# EAGLE design MikroBusSilToDil (EAGLE 6.4)
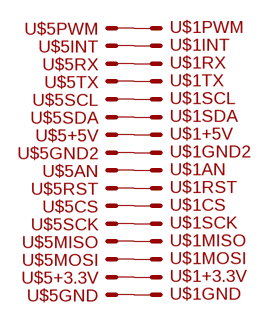
[diagram p0: schematic, sheet 1]

## Parts
U$1  MIKROBUS900MIL  [MIKROBUS]
U$5  MIKROBUSSIL  [MIKROBUS_SIL]

## Nets
N$1: U$1.PWM U$5.PWM
N$2: U$1.INT U$5.INT
N$3: U$1.RX U$5.RX
N$4: U$1.TX U$5.TX
N$5: U$1.SCL U$5.SCL
N$6: U$1.SDA U$5.SDA
N$7: U$1.+5V U$5.+5V
N$8: U$1.GND2 U$5.GND2
N$9: U$1.AN U$5.AN
N$10: U$1.RST U$5.RST
N$11: U$1.CS U$5.CS
N$12: U$1.SCK U$5.SCK
N$13: U$1.MISO U$5.MISO
N$14: U$1.MOSI U$5.MOSI
N$15: U$1.+3.3V U$5.+3.3V
N$16: U$1.GND U$5.GND

## Library data of the parts
U$1 U$5 = lieven:MIKROBUS

## Board
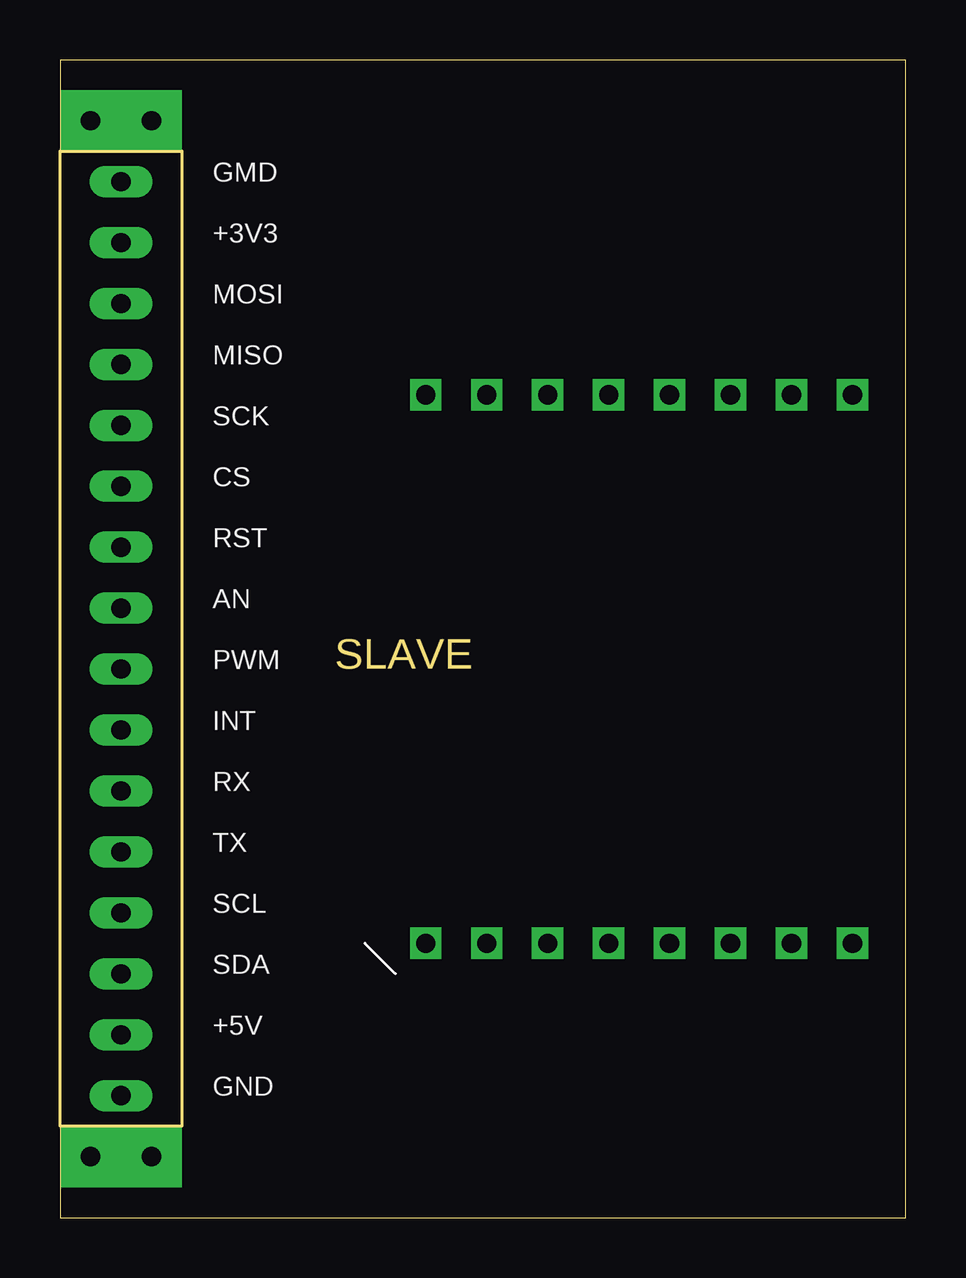
[diagram p1: board, top side]
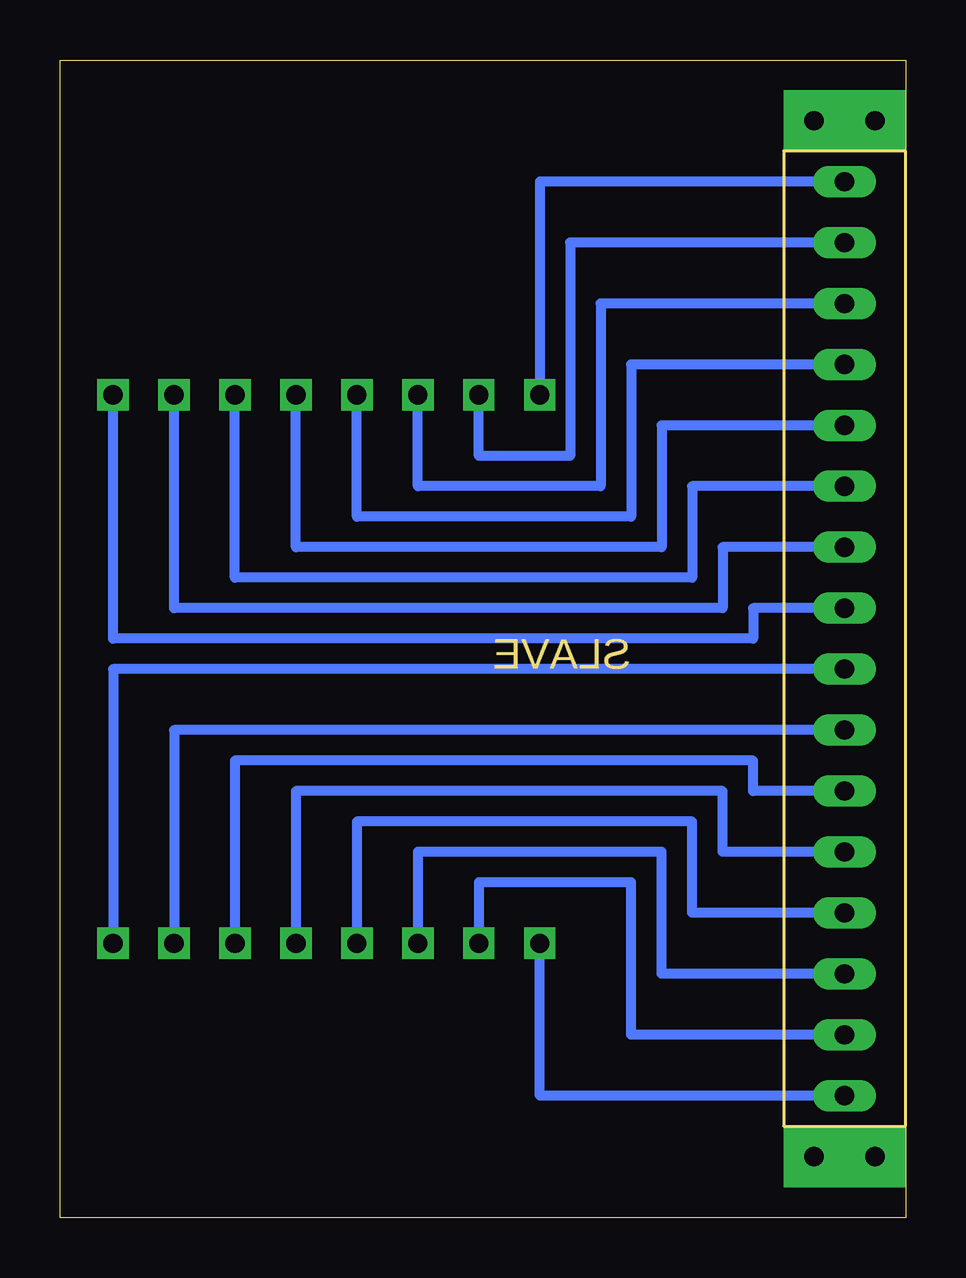
[diagram p2: board, bottom side, seen from below]

Size 35.23 x 48.25 mm. Coordinates in mm from the lower left corner, seen from the top.
Outline: 0,0 35.23,0 35.23,48.25 0,48.25 0,0
Copper layers (1*16): Top 0.035mm / dielectric 1.5mm / Bottom 0.035mm
Design rules "default": minimum track width 10mil, minimum drill 24mil, track to track 8mil, track to pad 8mil, pad to pad 8mil, via to via 8mil, smd to smd 8mil, copper to edge 40mil, drill to drill 8mil, minimum pad ring 10mil, minimum via ring 8mil, stop-mask expansion 4mil, vias tented up to drill 0mil, thermal gap 10mil

### Footprints (pad centres in the part's own frame; a part is rotated, then mirrored left to right if it is on the bottom)
MIKROBUS = drill 0.8 square: +3.3V 0,2.54; +5V 22.86,2.54; AN 0,17.78; CS 0,12.7; GND 0,0; GND2 22.86,0; INT 22.86,15.24; MISO 0,7.62; MOSI 0,5.08; PWM 22.86,17.78; RST 0,15.24; RX 22.86,12.7; SCK 0,10.16; SCL 22.86,7.62; SDA 22.86,5.08; TX 22.86,10.16
MIKROBUS_SIL = drill 0.8 long: +3.3V 0,15.24; +5V 0,-17.78; AN 0,0; CS 0,5.08; GND 0,17.78; GND2 0,-20.32; INT 0,-5.08; MISO 0,10.16; MOSI 0,12.7; PWM 0,-2.54; RST 0,2.54; RX 0,-7.62; SCK 0,7.62; SCL 0,-12.7; SDA 0,-15.24; TX 0,-10.16 | drill 0.8 pad 2.54 square: P$1 1.27,-22.86; P$2 1.27,20.32; P$3 -1.27,20.32; P$4 -1.27,-22.86

### Placement (x,y rotation side)
U$1  15.24,34.29 270 top
U$5  2.54,25.4 0 top

### Tracks (layer width: path | path; a pad name or v marks a point on that pad's centre or on a via)
N$1
  Bottom 0.406: U$5.PWM 33.02,22.86 U$1.PWM
N$2
  Bottom 0.406: U$5.INT 30.48,20.32 U$1.INT
N$3
  Bottom 0.406: U$5.RX 6.35,17.78 6.35,19.05 27.94,19.05 U$1.RX
N$4
  Bottom 0.406: U$5.TX 7.62,15.24 7.62,17.78 25.4,17.78 U$1.TX
N$5
  Bottom 0.406: U$5.SCL 8.89,12.7 8.89,16.51 22.86,16.51 U$1.SCL
N$6
  Bottom 0.406: U$5.SDA 10.16,10.16 10.16,15.24 20.32,15.24 U$1.SDA
N$7
  Bottom 0.406: U$5.+5V 11.43,7.62 11.43,13.97 17.78,13.97 U$1.+5V
N$8
  Bottom 0.406: U$5.GND2 15.24,5.08 U$1.GND2
N$9
  Bottom 0.406: U$5.AN 6.35,25.4 6.35,24.13 33.02,24.13 U$1.AN
N$10
  Bottom 0.406: U$5.RST 7.62,27.94 7.62,25.4 30.48,25.4 U$1.RST
N$11
  Bottom 0.406: U$5.CS 8.89,30.48 8.89,26.67 27.94,26.67 U$1.CS
N$12
  Bottom 0.406: U$5.SCK 10.16,33.02 10.16,27.94 25.4,27.94 U$1.SCK
N$13
  Bottom 0.406: U$5.MISO 11.43,35.56 11.43,29.21 22.86,29.21 U$1.MISO
N$14
  Bottom 0.406: U$5.MOSI 12.7,38.1 12.7,30.48 20.32,30.48 U$1.MOSI
N$15
  Bottom 0.406: U$5.+3.3V 13.97,40.64 13.97,31.75 17.78,31.75 U$1.+3.3V
N$16
  Bottom 0.406: U$5.GND 15.24,43.18 U$1.GND